# Altium schematic sheet 总原理框图.SchDoc
size A4
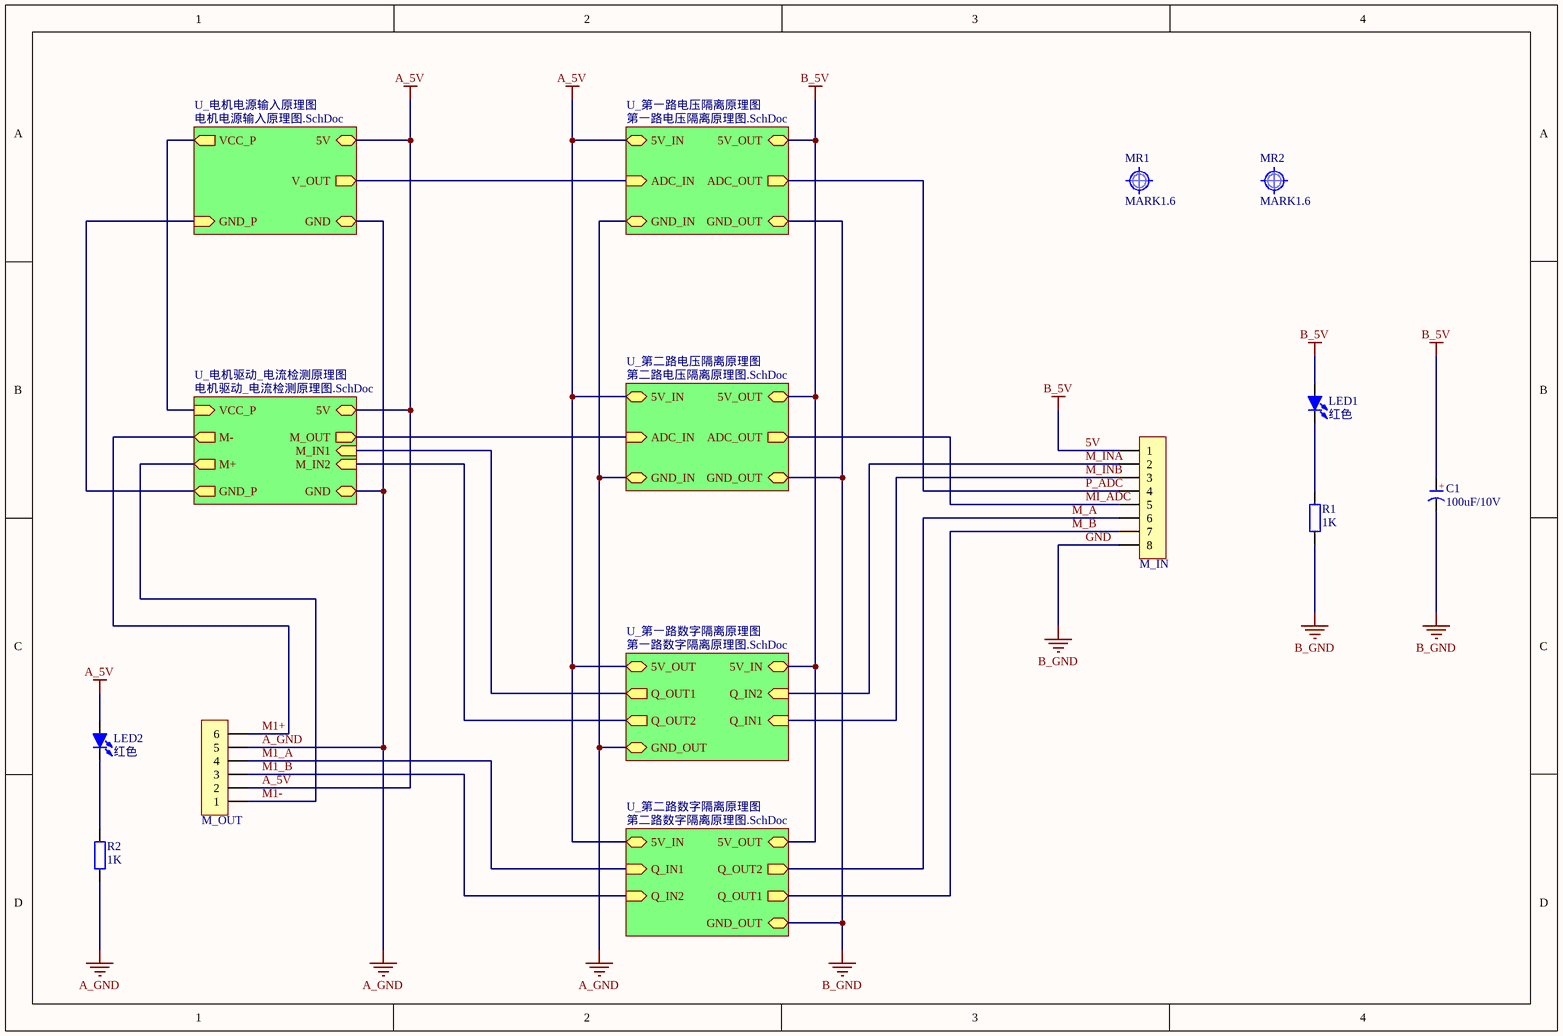
[diagram p0: 总原理框图.SchDoc]

## Parts
C1  100uF/10V  [CD B(3528)]
LED1  红色  [LED 0603W]
LED2  红色  [LED 0603W]
M_IN  HDR-1X8  [ZH1.5-WI-8P]  (value not drawn)
M_OUT  HDR-1X6  [PH2.0-WI-6P]  (value not drawn)
MR1  MARK1.6  [Mark 1.6]
MR2  MARK1.6  [Mark 1.6]
R1  1K  [R 0603_M]
R2  1K  [R 0603_M]

## Sub-sheets
U_电机电源输入原理图 = 电机电源输入原理图.SchDoc: V_OUT (out), VCC_P (out), GND_P (in), 5V (bidir), GND (bidir)
U_电机驱动_电流检测原理图 = 电机驱动_电流检测原理图.SchDoc: 5V (bidir), VCC_P (in), GND_P (out), M+ (out), M- (out), GND (bidir), M_OUT (out), M_IN1 (in), M_IN2 (in)
U_第一路数字隔离原理图 = 第一路数字隔离原理图.SchDoc: 5V_IN (bidir), 5V_OUT (bidir), GND_OUT (bidir), Q_IN2 (in), Q_IN1 (in), Q_OUT1 (out), Q_OUT2 (out)
U_第一路电压隔离原理图 = 第一路电压隔离原理图.SchDoc: ADC_IN (in), ADC_OUT (out), 5V_IN (bidir), 5V_OUT (bidir), GND_IN (bidir), GND_OUT (bidir)
U_第二路数字隔离原理图 = 第二路数字隔离原理图.SchDoc: 5V_IN (bidir), 5V_OUT (bidir), GND_OUT (bidir), Q_IN2 (in), Q_IN1 (in), Q_OUT1 (out), Q_OUT2 (out)
U_第二路电压隔离原理图 = 第二路电压隔离原理图.SchDoc: ADC_IN (in), ADC_OUT (out), 5V_IN (bidir), 5V_OUT (bidir), GND_IN (bidir), GND_OUT (bidir)

## Nets
5V: C1.1(A) LED1.1(A) M_IN.1 ; sheet U_第一路数字隔离原理图/5V_IN, sheet U_第一路电压隔离原理图/5V_OUT, sheet U_第二路数字隔离原理图/5V_OUT, sheet U_第二路电压隔离原理图/5V_OUT  [also labelled B_5V]
A_5V: LED2.1(A) M_OUT.2 ; sheet U_电机电源输入原理图/5V, sheet U_电机驱动_电流检测原理图/5V, sheet U_第一路数字隔离原理图/5V_OUT, sheet U_第一路电压隔离原理图/5V_IN, sheet U_第二路数字隔离原理图/5V_IN, sheet U_第二路电压隔离原理图/5V_IN
A_GND: M_OUT.5 R2.1 ; sheet U_电机电源输入原理图/GND, sheet U_电机驱动_电流检测原理图/GND, sheet U_第一路数字隔离原理图/GND_OUT, sheet U_第一路电压隔离原理图/GND_IN, sheet U_第二路电压隔离原理图/GND_IN
GND: C1.2(K) M_IN.8 R1.1 ; sheet U_第一路电压隔离原理图/GND_OUT, sheet U_第二路数字隔离原理图/GND_OUT, sheet U_第二路电压隔离原理图/GND_OUT  [also labelled B_GND]
M1+: M_OUT.6 ; sheet U_电机驱动_电流检测原理图/M-
M1-: M_OUT.1 ; sheet U_电机驱动_电流检测原理图/M+
M1_A: M_OUT.4 ; sheet U_第二路数字隔离原理图/Q_IN1
M1_B: M_OUT.3 ; sheet U_第二路数字隔离原理图/Q_IN2
M_A: M_IN.6 ; sheet U_第二路数字隔离原理图/Q_OUT2
M_B: M_IN.7 ; sheet U_第二路数字隔离原理图/Q_OUT1
M_INA: M_IN.2 ; sheet U_第一路数字隔离原理图/Q_IN2
M_INB: M_IN.3 ; sheet U_第一路数字隔离原理图/Q_IN1
MI_ADC: M_IN.5 ; sheet U_第二路电压隔离原理图/ADC_OUT
P_ADC: M_IN.4 ; sheet U_第一路电压隔离原理图/ADC_OUT
NetLED1_2: LED1.2(K) R1.2
NetLED2_2: LED2.2(K) R2.2
(unnamed): sheet U_电机电源输入原理图/V_OUT, sheet U_第一路电压隔离原理图/ADC_IN
(unnamed): sheet U_电机电源输入原理图/VCC_P, sheet U_电机驱动_电流检测原理图/VCC_P
(unnamed): sheet U_电机电源输入原理图/GND_P, sheet U_电机驱动_电流检测原理图/GND_P
(unnamed): sheet U_电机驱动_电流检测原理图/M_OUT, sheet U_第二路电压隔离原理图/ADC_IN
(unnamed): sheet U_电机驱动_电流检测原理图/M_IN1, sheet U_第一路数字隔离原理图/Q_OUT1
(unnamed): sheet U_电机驱动_电流检测原理图/M_IN2, sheet U_第一路数字隔离原理图/Q_OUT2

## Notes on the sheet
- (in symbol C-CD) +

## Library data of the parts
C1 = C-CD: 贴片钽电容; 版权归属: 源创客; BOM名称: 贴片钽电容; 学习资源: www.ooocke.com
LED1 LED2 = LED-SMD: 贴片LED; 版权归属: 源创客; BOM名称: 贴片LED; 学习资源: www.ooocke.com
M_IN = Header 8: 8P接插件; 版权归属: 源创客; BOM名称: 8P接插件; 学习资源: www.ooocke.com
M_OUT = Header 6: 6P接插件; 版权归属: 源创客; BOM名称: 6P接插件; 学习资源: www.ooocke.com
MR1 MR2 = MARK: 光学定位点; 版权归属: 源创客; BOM名称: 光学定位点; 学习资源: www.ooocke.com
R1 R2 = R: 贴片电阻; 版权归属: 源创客; BOM名称: 贴片电阻; 学习资源: www.ooocke.com